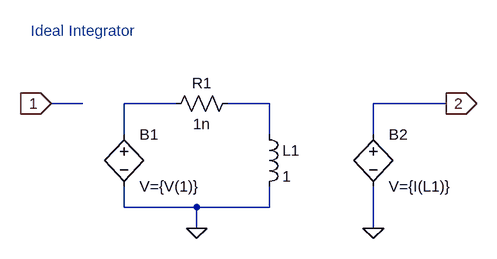
[diagram p0: schematic integrator.asc]
integrator.asc, the LTspice schematic file:
Version 4
SHEET 1 880 680
WIRE 32 96 -16 96
WIRE 176 96 96 96
WIRE 320 96 256 96
WIRE 592 96 480 96
WIRE 96 144 96 96
WIRE 320 144 320 96
WIRE 480 144 480 96
WIRE 96 256 96 224
WIRE 208 256 96 256
WIRE 320 256 320 224
WIRE 320 256 208 256
WIRE 208 288 208 256
WIRE 480 288 480 224
FLAG -16 96 1
IOPIN -16 96 In
FLAG 208 288 0
FLAG 480 288 0
FLAG 592 96 2
IOPIN 592 96 Out
SYMBOL bv 96 128 R0
SYMATTR InstName B1
SYMATTR Value V={V(1)}
SYMBOL bv 480 128 R0
SYMATTR InstName B2
SYMATTR Value V={I(L1)}
SYMBOL res 272 80 R90
WINDOW 0 0 56 VBottom 2
WINDOW 3 32 56 VTop 2
SYMATTR InstName R1
SYMATTR Value 1n
SYMBOL ind 304 128 R0
SYMATTR InstName L1
SYMATTR Value 1
TEXT -48 -16 Left 2 ;Ideal Integrator

The netlist it stands for:
* integrator.asc
B1 N001 0 V={V(1)}
B2 2 0 V={I(L1)}
R1 N002 N001 1n
L1 N002 0 1
* Ideal Integrator
.backanno
.end